# Altium schematic sheet Deel_2_transistor.SchDoc: Soldeerstation
size A4; DrawnBy: Kenneth Rennen; Revision: 1.0; SheetNumber: 3; SheetTotal: 5; Sheet of: 3/5; Number: PXL_1EAI_12102667
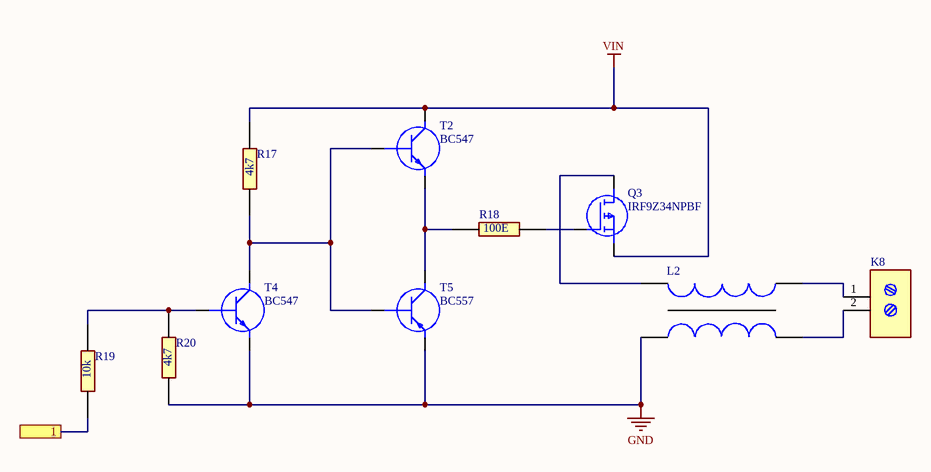
[diagram p0: Deel_2_transistor.SchDoc]

## Parts
K8  schroefconnector  [schroefconnector]  (value not drawn)
L2  cmsmoorspoel  [CMsmoorspoel]  (value not drawn)
Q3  IRF9Z34NPBF  [irf9z34npbf]
R17  4k7  [4k7]
R18  100E  [100ohm]
R19  10k  [10k]
R20  4k7  [4k7]
T2  BC547  [BC547CBU]
T4  BC547  [BC547CBU]
T5  BC557  [BC557C]

## Ports
1

## Nets
GND: L2.2(SEC+) R20.1 T4.3(E) T5.1(E)
VIN: Q3.2(S) R17.2 T2.1(C)
1: R19.1 ; port 1
NetK8_1: K8.1 L2.3(SEC-)
NetK8_2: K8.2 L2.4(PRI-)
NetL2_1: L2.1(PRI+) Q3.3(D)
NetQ3_1: Q3.1(G) R18.2
NetR17_1: R17.1 T2.2(B) T4.1(C) T5.2(B)
NetR18_1: R18.1 T2.3(E) T5.3(C)
NetR19_2: R19.2 R20.2 T4.2(B)

## Library data of the parts
K8 = schroefconnector: Connector 1716020000; Manufacturer_Name: Weidmuller; Datasheet Link: https://catalog.weidmueller.com/catalog/Start.do?ObjectID=1716020000&_ga=2.21797499.1716783809.1613378202-511725545.1613378202; Manufacturer_Part_Number: 1716020000
L2 = cmsmoorspoel: Transformer CM2545X171B-10; Manufacturer_Name: Laird Technologies; Datasheet Link: https://datasheet.datasheetarchive.com/originals/dk/DKDS-7/122753.pdf; Height: 9.5mm; Manufacturer_Part_Number: CM2545X171B-10
Q3 = IRF9Z34NPBF: MOSFET (P-Channel); Manufacturer_Name: Infineon; Datasheet Link: https://componentsearchengine.com//IRF9Z34NPBF.pdf; Height: 4.69mm; Mouser2 Part Number: 942-IRF9Z34NPBF; Mouser2 Price/Stock: https://www.mouser.com/Search/Refine.aspx?Keyword=942-IRF9Z34NPBF; Manufacturer_Part_Number: IRF9Z34NPBF
R17 R20 = 4k7: Resistor; Manufacturer_Name: TE Connectivity; Manufacturer_Part_Number: CPF0805B100RE1; Datasheet Link: https://datasheet.datasheetarchive.com/originals/distributors/DKDS-21/401696.pdf; Height: 0.65mm; Mouser Part Number: 279-CPF0805B100RE1; Mouser Price/Stock: https://www.mouser.co.uk/ProductDetail/TE-Connectivity-Holsworthy/CPF0805B100RE1?qs=9ylKvqdyudkCWLPT1QvLZQ%3D%3D; Arrow Part Number: CPF0805B100RE1; Arrow Price/Stock: https://www.arrow.com/en/products/cpf0805b100re1/te-connectivity?region=nac
R18 = 100ohm: Resistor; Manufacturer_Name: TE Connectivity; Manufacturer_Part_Number: CPF0805B100RE1; Datasheet Link: https://datasheet.datasheetarchive.com/originals/distributors/DKDS-21/401696.pdf; Height: 0.65mm; Mouser Part Number: 279-CPF0805B100RE1; Mouser Price/Stock: https://www.mouser.co.uk/ProductDetail/TE-Connectivity-Holsworthy/CPF0805B100RE1?qs=9ylKvqdyudkCWLPT1QvLZQ%3D%3D; Arrow Part Number: CPF0805B100RE1; Arrow Price/Stock: https://www.arrow.com/en/products/cpf0805b100re1/te-connectivity?region=nac
R19 = 10k: Resistor; Manufacturer_Name: TE Connectivity; Manufacturer_Part_Number: CPF0805B100RE1; Datasheet Link: https://datasheet.datasheetarchive.com/originals/distributors/DKDS-21/401696.pdf; Height: 0.65mm; Mouser Part Number: 279-CPF0805B100RE1; Mouser Price/Stock: https://www.mouser.co.uk/ProductDetail/TE-Connectivity-Holsworthy/CPF0805B100RE1?qs=9ylKvqdyudkCWLPT1QvLZQ%3D%3D; Arrow Part Number: CPF0805B100RE1; Arrow Price/Stock: https://www.arrow.com/en/products/cpf0805b100re1/te-connectivity?region=nac
T2 T4 = BC547CBU: Transistor BJT NPN; Manufacturer_Name: ON Semiconductor; Datasheet Link: https://www.onsemi.com/pdf/datasheet/bc550-d.pdf; Height: 5.33mm; Manufacturer_Part_Number: BC547CBU
T5 = BC557C: Transistor BJT PNP; Manufacturer_Name: NXP; Datasheet Link: http://uk.rs-online.com/web/p/products/1124775; Height: 5.2mm; Manufacturer_Part_Number: BC557C; Mouser Part Number: 771-BC557C; Mouser Price/Stock: https://www.mouser.co.uk/ProductDetail/NXP-Semiconductors/BC557C?qs=84A%2FDAdkstLO1yR4NjQrgg%3D%3D